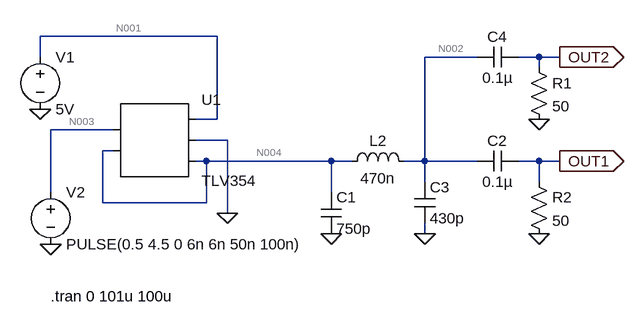
[diagram p0: schematic output-amplifier-sim.asc]
* output-amplifier-sim.asc
V1 N001 0 5V
V2 N003 0 PULSE(0.5 4.5 0 6n 6n 50n 100n)
C1 N004 0 750p
L2 N004 N002 470n
C2 OUT1 N002 0.1µ
R2 OUT1 0 50
* U1: TLV354 (symbol AutoGenerated\TLV354 not available, pins judged from their places): pin1=N003 pin2=N004 pin3=N001 pin4=0 pin5=N004
C3 N002 0 430p
C4 OUT2 N002 0.1µ
R1 OUT2 0 50
.tran 0 101u 100u
.backanno
.end

* Results of the author's LTspice run, read from the files saved beside the schematic
* Operating Point, zero values left out:
*   V(n001) = 5 V
*   V(n003) = 500 mV
*   V(n004) = 501.8 mV
*   V(n002) = 501.8 mV
*   I(V2) = 6.935 pA
*   I(V1) = -5.2 mA
*   Ix(u1:IN+) = -7.001 pA
*   Ix(u1:IN-) = -8.104 pA
*   Ix(u1:VCC) = 5.2 mA
*   Ix(u1:VEE) = -5.2 mA
*   Ix(u1:OUT) = 8.037 pA
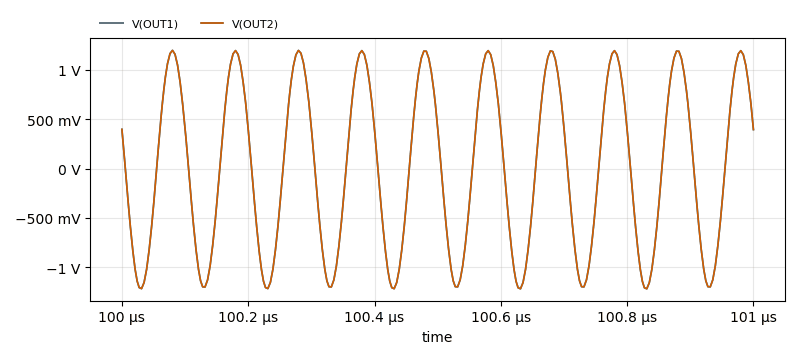
[diagram p1: Transient Analysis of output-amplifier-sim.asc, plotted from the saved traces]
* Transient Analysis, 1 run:
*   V(OUT1): min -1.219 V, max 1.198 V, average 5.641 mV, rms 851.6 mV, last 395 mV
*   V(OUT2): min -1.219 V, max 1.198 V, average 5.641 mV, rms 851.6 mV, last 395 mV